# Altium project PCB_Project1.PrjPCB
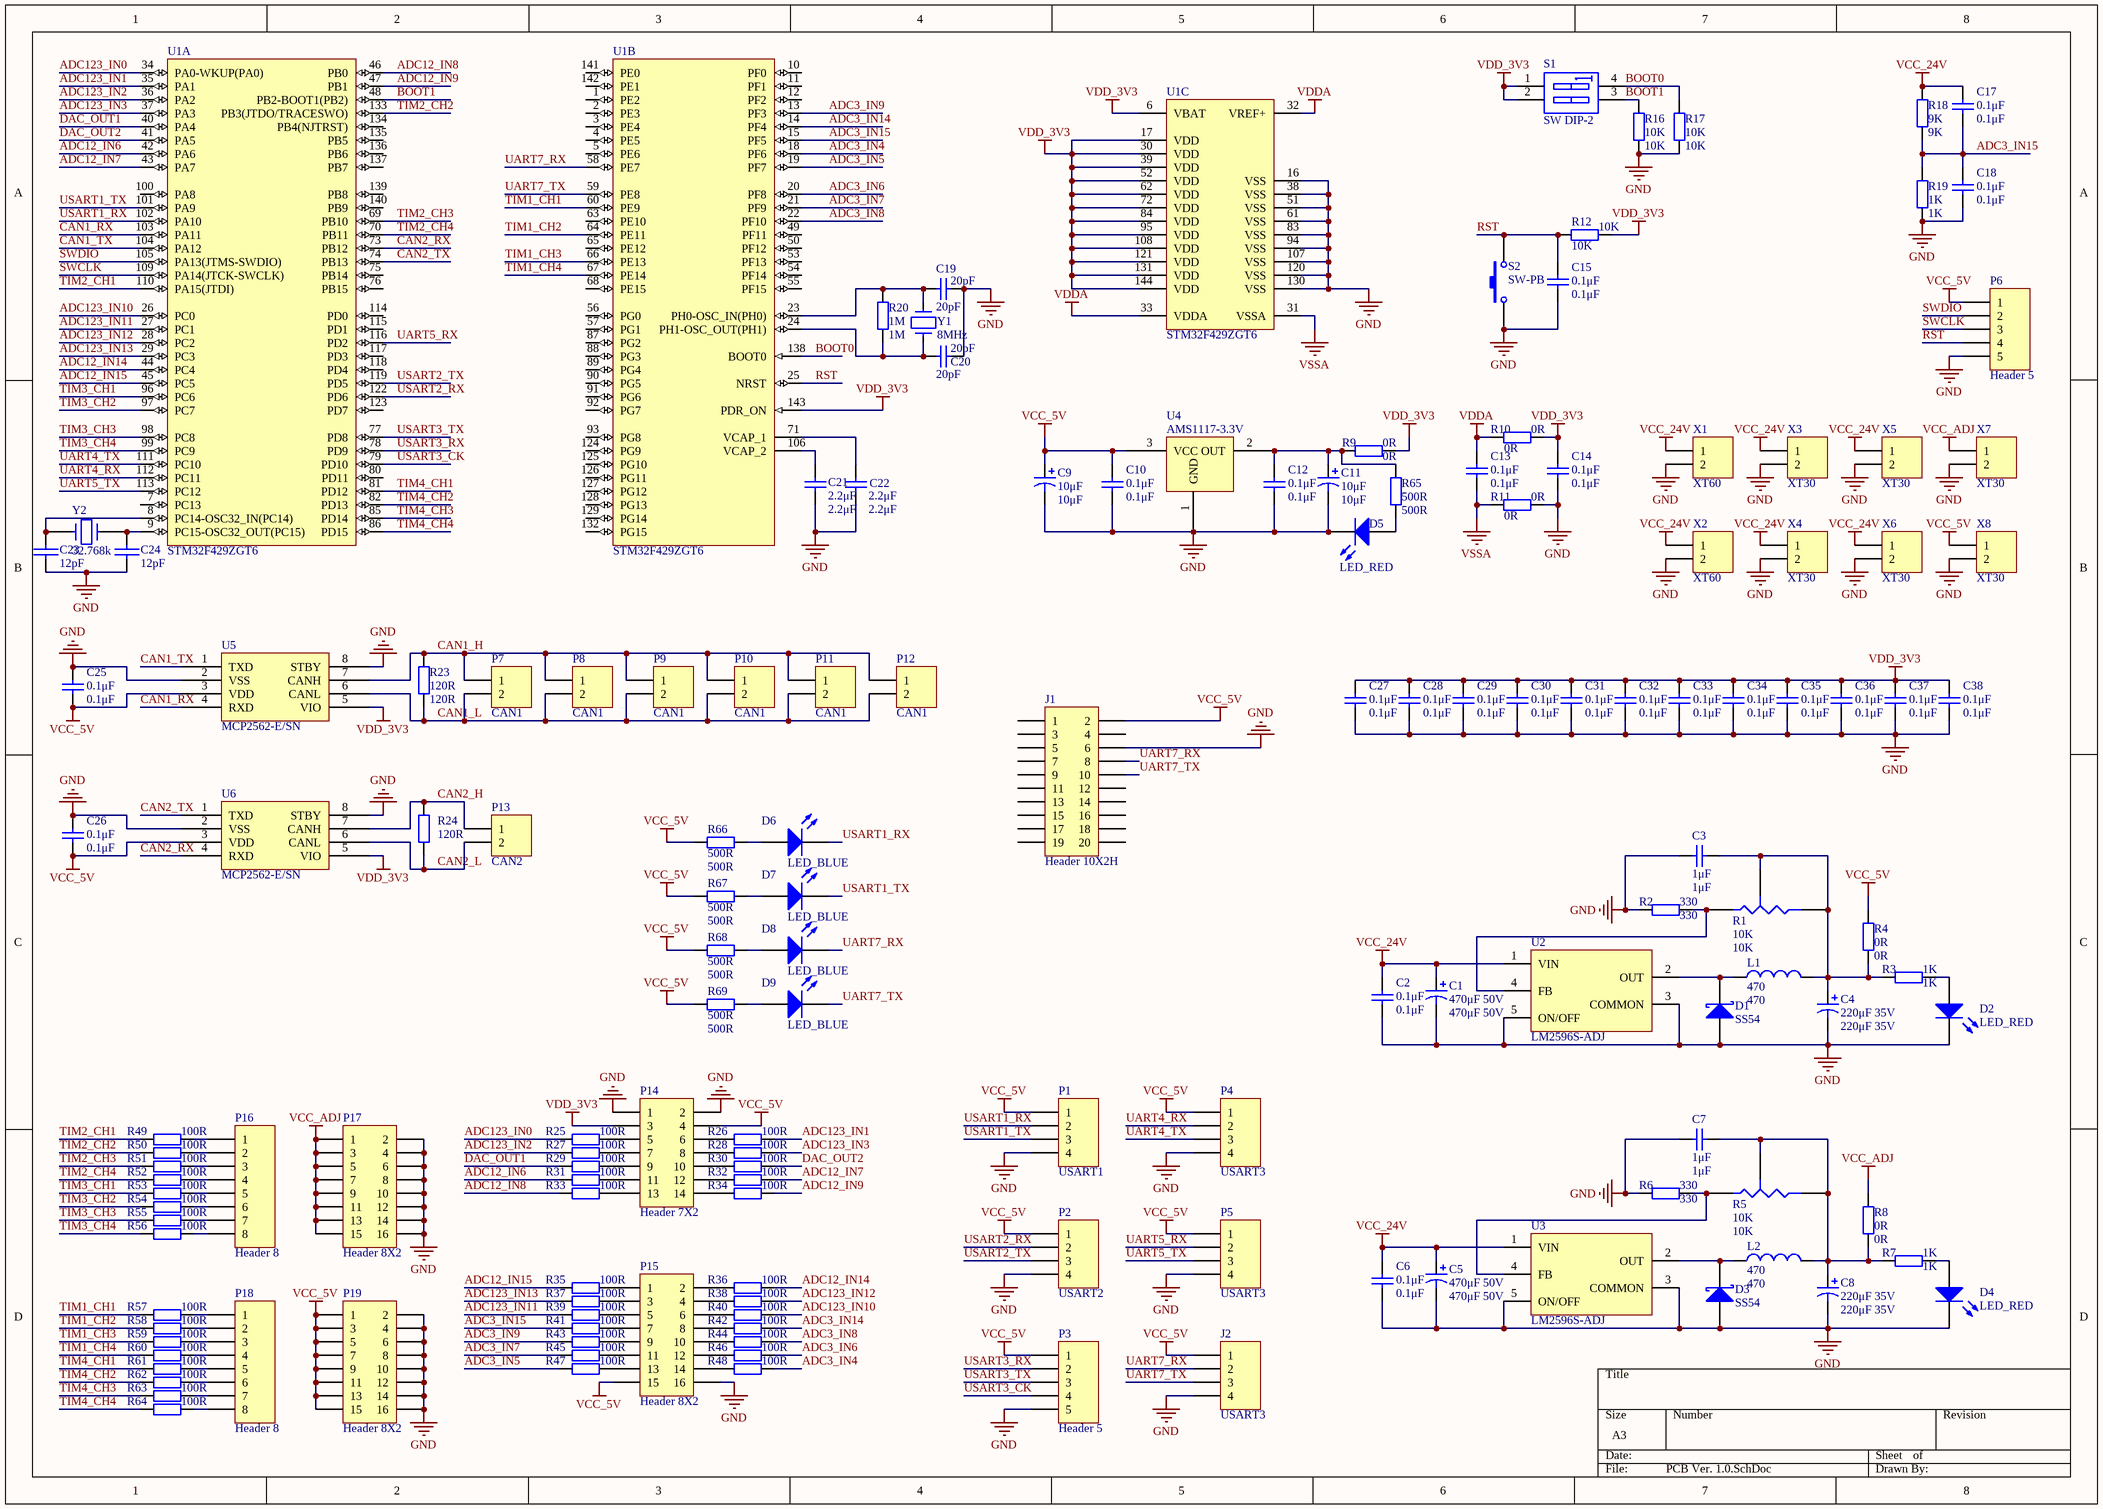
[diagram p0: PCB Ver. 1.0.SchDoc]
1 sheet, 151 parts. Net scope: global (net labels, ports and power ports of the same name join across sheets).
Board file: PCB1.PcbDoc

## Sheet PCB Ver. 1.0.SchDoc
size A3

### Parts
C1  470μF 50V  [RB-.2/.4]
C2  0.1μF  [0805]
C3  1μF  [0805]
C4  220μF 35V  [RB-.2/.4]
C5  470μF 50V  [RB-.2/.4]
C6  0.1μF  [0805]
C7  1μF  [0805]
C8  220μF 35V  [RB-.2/.4]
C9  10μF  [0805]
C10  0.1μF  [0805]
C11  10μF  [0805]
C12  0.1μF  [0805]
C13  0.1μF  [0805]
C14  0.1μF  [0805]
C15  0.1μF  [0805]
C17  0.1μF  [0805]
C18  0.1μF  [0805]
C19  20pF  [0805]
C20  20pF  [0805]
C21  2.2μF  [0805]
C22  2.2μF  [0805]
C23  12pF  [0805]
C24  12pF  [0805]
C25  0.1μF  [0805]
C26  0.1μF  [0805]
C27  0.1μF  [0805]
C28  0.1μF  [0805]
C29  0.1μF  [0805]
C30  0.1μF  [0805]
C31  0.1μF  [0805]
C32  0.1μF  [0805]
C33  0.1μF  [0805]
C34  0.1μF  [0805]
C35  0.1μF  [0805]
C36  0.1μF  [0805]
C37  0.1μF  [0805]
C38  0.1μF  [0805]
D1  SS54  [DO-214AA]
D2  LED_RED  [1206_LED]
D3  SS54  [DO-214AA]
D4  LED_RED  [1206_LED]
D5  LED_RED  [1206_LED]
D6  LED_BLUE  [1206_LED]
D7  LED_BLUE  [1206_LED]
D8  LED_BLUE  [1206_LED]
D9  LED_BLUE  [1206_LED]
J1  Header 10X2H  [HDR2X10]
J2  USART3  [HDR1X4]
L1  470  [12*12*7贴片电感]
L2  470  [12*12*7贴片电感]
P1  USART1  [HDR1X4]
P2  USART2  [HDR1X4]
P3  Header 5  [HDR1X5]
P4  USART3  [HDR1X4]
P5  USART3  [HDR1X4]
P6  Header 5  [HDR1X5]
P7  CAN1  [HDR1X2]
P8  CAN1  [HDR1X2]
P9  CAN1  [HDR1X2]
P10  CAN1  [HDR1X2]
P11  CAN1  [HDR1X2]
P12  CAN1  [HDR1X2]
P13  CAN2  [HDR1X2]
P14  Header 7X2  [HDR2X7]
P15  Header 8X2  [HDR2X8]
P16  Header 8  [HDR1X8]
P17  Header 8X2  [HDR2X8]
P18  Header 8  [HDR1X8]
P19  Header 8X2  [HDR2X8]
R1  10K  [3296]
R2  330  [0805]
R3  1K  [0805]
R4  0R  [0805]
R5  10K  [3296]
R6  330  [0805]
R7  1K  [0805]
R8  0R  [0805]
R9  0R  [0805]
R10  0R  [0805]
R11  0R  [0805]
R12  10K  [0805]
R16  10K  [0805]
R17  10K  [0805]
R18  9K  [0805]
R19  1K  [0805]
R20  1M  [0805]
R23  120R  [0805]
R24  120R  [0805]
R25  100R  [0805]
R26  100R  [0805]
R27  100R  [0805]
R28  100R  [0805]
R29  100R  [0805]
R30  100R  [0805]
R31  100R  [0805]
R32  100R  [0805]
R33  100R  [0805]
R34  100R  [0805]
R35  100R  [0805]
R36  100R  [0805]
R37  100R  [0805]
R38  100R  [0805]
R39  100R  [0805]
R40  100R  [0805]
R41  100R  [0805]
R42  100R  [0805]
R43  100R  [0805]
R44  100R  [0805]
R45  100R  [0805]
R46  100R  [0805]
R47  100R  [0805]
R48  100R  [0805]
R49  100R  [0805]
R50  100R  [0805]
R51  100R  [0805]
R52  100R  [0805]
R53  100R  [0805]
R54  100R  [0805]
R55  100R  [0805]
R56  100R  [0805]
R57  100R  [0805]
R58  100R  [0805]
R59  100R  [0805]
R60  100R  [0805]
R61  100R  [0805]
R62  100R  [0805]
R63  100R  [0805]
R64  100R  [0805]
R65  500R  [0805]
R66  500R  [0805]
R67  500R  [0805]
R68  500R  [0805]
R69  500R  [0805]
S1  SW DIP-2  [DIP-4]
S2  SW-PB  [3*6 开关]
U1  STM32F429ZGT6  [STM-LQFP144_N]  (parts A,B,C of 3)
U2  LM2596S-ADJ  [TO-263]
U3  LM2596S-ADJ  [TO-263]
U4  AMS1117-3.3V  [SOT223]
U5  MCP2562-E/SN  [SO-8]
U6  MCP2562-E/SN  [SO-8]
X1  XT60  [XT60PB]
X2  XT60  [XT60PB]
X3  XT30  [XT30UPB]
X4  XT30  [XT30UPB]
X5  XT30  [XT30UPB]
X6  XT30  [XT30UPB]
X7  XT30  [XT30UPB]
X8  XT30  [XT30UPB]
Y1  8MHz  [XTAL]
Y2  32.768k  [MHDR1X2]

### Nets
GND: C1.2 C2.1 C3.2 C4.2 C5.2 C6.1 C7.2 C8.2 C9.2 C10.1 C11.2 C12.1 C14.1 C15.2 C18.1 C19.2 C20.2 C21.1 C22.1 C23.1 C24.1 C25.2 C26.2 C27.1 C28.1 C29.1 C30.1 C31.1 C32.1 C33.1 C34.1 C35.1 C36.1 C37.1 C38.1 D1.1(A) D2.2(K) D3.1(A) D4.2(K) D5.2(K) J1.6 J2.4 P1.4 P2.4 P3.5 P4.4 P5.4 P6.5 P14.1 P14.2 P15.16 P17.2 P17.4 P17.6 P17.8 P17.10 P17.12 P17.14 P17.16 P19.2 P19.4 P19.6 P19.8 P19.10 P19.12 P19.14 P19.16 R2.1 R6.1 R11.2 R16.1 R17.1 R19.1 S2.1 U1.16(VSS) U1.38(VSS) U1.51(VSS) U1.61(VSS) U1.83(VSS) U1.94(VSS) U1.107(VSS) U1.120(VSS) U1.130(VSS) U2.3(COMMON) U2.5(ON/OFF) U3.3(COMMON) U3.5(ON/OFF) U4.1(GND) U5.2(VSS) U5.8(STBY) U6.2(VSS) U6.8(STBY) X1.2 X2.2 X3.2 X4.2 X5.2 X6.2 X7.2 X8.2
VCC_5V: C9.1 C10.2 C25.1 C26.1 J1.2 J2.1 P1.1 P2.1 P3.1 P4.1 P5.1 P6.1 P14.4 P15.15 P19.1 P19.3 P19.5 P19.7 P19.9 P19.11 P19.13 P19.15 R4.2 R66.2 R67.2 R68.2 R69.2 U4.3(VCC) U5.3(VDD) U6.3(VDD) X8.1
VCC_24V: C1.1 C2.2 C5.1 C6.2 C17.2 R18.2 U2.1(VIN) U3.1(VIN) X1.1 X2.1 X3.1 X4.1 X5.1 X6.1
VCC_ADJ: P17.1 P17.3 P17.5 P17.7 P17.9 P17.11 P17.13 P17.15 R8.2 X7.1
VDD_3V3: C14.2 C27.2 C28.2 C29.2 C30.2 C31.2 C32.2 C33.2 C34.2 C35.2 C36.2 C37.2 C38.2 P14.3 R9.2 R10.2 R12.2 S1.1(A1) S1.2(A2) U1.6(VBAT) U1.17(VDD) U1.30(VDD) U1.39(VDD) U1.52(VDD) U1.62(VDD) U1.72(VDD) U1.84(VDD) U1.95(VDD) U1.108(VDD) U1.121(VDD) U1.131(VDD) U1.143(PDR_ON) U1.144(VDD) U5.5(VIO) U6.5(VIO)
VDDA: C13.2 R10.1 U1.32(VREF+) U1.33(VDDA)
VSSA: C13.1 R11.1 U1.31(VSSA)
ADC3_IN4: R48.2 U1.18(PF6)
ADC3_IN5: R47.1 U1.19(PF7)
ADC3_IN6: R46.2 U1.20(PF8)
ADC3_IN7: R45.1 U1.21(PF9)
ADC3_IN8: R44.2 U1.22(PF10)
ADC3_IN9: R43.1 U1.13(PF3)
ADC3_IN14: R42.2 U1.14(PF4)
ADC3_IN15: C17.1 C18.2 R18.1 R19.2 R41.1 U1.15(PF5)
ADC12_IN6: R31.1 U1.42(PA6)
ADC12_IN7: R32.2 U1.43(PA7)
ADC12_IN8: R33.1 U1.46(PB0)
ADC12_IN9: R34.2 U1.47(PB1)
ADC12_IN14: R36.2 U1.44(PC4)
ADC12_IN15: R35.1 U1.45(PC5)
ADC123_IN0: R25.1 U1.34(PA0-WKUP(PA0))
ADC123_IN1: R26.2 U1.35(PA1)
ADC123_IN2: R27.1 U1.36(PA2)
ADC123_IN3: R28.2 U1.37(PA3)
ADC123_IN10: R40.2 U1.26(PC0)
ADC123_IN11: R39.1 U1.27(PC1)
ADC123_IN12: R38.2 U1.28(PC2)
ADC123_IN13: R37.1 U1.29(PC3)
BOOT0: R17.2 S1.4(B1) U1.138(BOOT0)
BOOT1: R16.2 S1.3(B2) U1.48(PB2-BOOT1(PB2))
CAN1_H: P7.1 P8.1 P9.1 P10.1 P11.1 P12.1 R23.2 U5.7(CANH)
CAN1_L: P7.2 P8.2 P9.2 P10.2 P11.2 P12.2 R23.1 U5.6(CANL)
CAN1_RX: U1.103(PA11) U5.4(RXD)
CAN1_TX: U1.104(PA12) U5.1(TXD)
CAN2_H: P13.1 R24.2 U6.7(CANH)
CAN2_L: P13.2 R24.1 U6.6(CANL)
CAN2_RX: U1.73(PB12) U6.4(RXD)
CAN2_TX: U1.74(PB13) U6.1(TXD)
DAC_OUT1: R29.1 U1.40(PA4)
DAC_OUT2: R30.2 U1.41(PA5)
RST: C15.1 P6.4 R12.1 S2.2 U1.25(NRST)
SWCLK: P6.3 U1.109(PA14(JTCK-SWCLK))
SWDIO: P6.2 U1.105(PA13(JTMS-SWDIO))
TIM1_CH1: R57.1 U1.60(PE9)
TIM1_CH2: R58.1 U1.64(PE11)
TIM1_CH3: R59.1 U1.66(PE13)
TIM1_CH4: R60.1 U1.67(PE14)
TIM2_CH1: R49.1 U1.110(PA15(JTDI))
TIM2_CH2: R50.1 U1.133(PB3(JTDO/TRACESWO))
TIM2_CH3: R51.1 U1.69(PB10)
TIM2_CH4: R52.1 U1.70(PB11)
TIM3_CH1: R53.1 U1.96(PC6)
TIM3_CH2: R54.1 U1.97(PC7)
TIM3_CH3: R55.1 U1.98(PC8)
TIM3_CH4: R56.1 U1.99(PC9)
TIM4_CH1: R61.1 U1.81(PD12)
TIM4_CH2: R62.1 U1.82(PD13)
TIM4_CH3: R63.1 U1.85(PD14)
TIM4_CH4: R64.1 U1.86(PD15)
UART4_RX: P4.2 U1.112(PC11)
UART4_TX: P4.3 U1.111(PC10)
UART5_RX: P5.2 U1.116(PD2)
UART5_TX: P5.3 U1.113(PC12)
UART7_RX: D8.2(K) J1.8 J2.2 U1.58(PE7)
UART7_TX: D9.2(K) J1.10 J2.3 U1.59(PE8)
USART1_RX: D6.2(K) P1.2 U1.102(PA10)
USART1_TX: D7.2(K) P1.3 U1.101(PA9)
USART2_RX: P2.2 U1.122(PD6)
USART2_TX: P2.3 U1.119(PD5)
USART3_CK: P3.4 U1.79(PD10)
USART3_RX: P3.2 U1.78(PD9)
USART3_TX: P3.3 U1.77(PD8)
NetC3_1: C3.1 C4.1 L1.2 R1.2(B) R1.3(TAP) R3.1 R4.1
NetC7_1: C7.1 C8.1 L2.2 R5.2(B) R5.3(TAP) R7.1 R8.1
NetC11_1: C11.1 C12.2 R9.1 R65.2 U4.2(OUT)
NetC19_1: C19.1 R20.2 U1.23(PH0-OSC_IN(PH0)) Y1.1
NetC20_1: C20.1 R20.1 U1.24(PH1-OSC_OUT(PH1)) Y1.2
NetC21_2: C21.2 U1.106(VCAP_2)
NetC22_2: C22.2 U1.71(VCAP_1)
NetC23_2: C23.2 U1.8(PC14-OSC32_IN(PC14)) Y2.2
NetC24_2: C24.2 U1.9(PC15-OSC32_OUT(PC15)) Y2.1
NetD1_2: D1.2(K) L1.1 U2.2(OUT)
NetD2_1: D2.1(A) R3.2
NetD3_2: D3.2(K) L2.1 U3.2(OUT)
NetD4_1: D4.1(A) R7.2
NetD5_1: D5.1(A) R65.1
NetD6_1: D6.1(A) R66.1
NetD7_1: D7.1(A) R67.1
NetD8_1: D8.1(A) R68.1
NetD9_1: D9.1(A) R69.1
NetP14_5: P14.5 R25.2
NetP14_6: P14.6 R26.1
NetP14_7: P14.7 R27.2
NetP14_8: P14.8 R28.1
NetP14_9: P14.9 R29.2
NetP14_10: P14.10 R30.1
NetP14_11: P14.11 R31.2
NetP14_12: P14.12 R32.1
NetP14_13: P14.13 R33.2
NetP14_14: P14.14 R34.1
NetP15_1: P15.1 R35.2
NetP15_2: P15.2 R36.1
NetP15_3: P15.3 R37.2
NetP15_4: P15.4 R38.1
NetP15_5: P15.5 R39.2
NetP15_6: P15.6 R40.1
NetP15_7: P15.7 R41.2
NetP15_8: P15.8 R42.1
NetP15_9: P15.9 R43.2
NetP15_10: P15.10 R44.1
NetP15_11: P15.11 R45.2
NetP15_12: P15.12 R46.1
NetP15_13: P15.13 R47.2
NetP15_14: P15.14 R48.1
NetP16_1: P16.1 R49.2
NetP16_2: P16.2 R50.2
NetP16_3: P16.3 R51.2
NetP16_4: P16.4 R52.2
NetP16_5: P16.5 R53.2
NetP16_6: P16.6 R54.2
NetP16_7: P16.7 R55.2
NetP16_8: P16.8 R56.2
NetP18_1: P18.1 R57.2
NetP18_2: P18.2 R58.2
NetP18_3: P18.3 R59.2
NetP18_4: P18.4 R60.2
NetP18_5: P18.5 R61.2
NetP18_6: P18.6 R62.2
NetP18_7: P18.7 R63.2
NetP18_8: P18.8 R64.2
NetR1_1: R1.1(A) R2.2 U2.4(FB)
NetR5_1: R5.1(A) R6.2 U3.4(FB)

Not connected (* = marked no-connect by the designer): J1 1 3 4 5 7 9 11 12 13 14 15 16 17 18 19 20; U1 1(PE2) 2(PE3) 3(PE4) 4(PE5) 5(PE6) 7(PC13) 10(PF0) 11(PF1) 12(PF2) 49(PF11) 50(PF12) 53(PF13) 54(PF14) 55(PF15) 56(PG0) 57(PG1) 63(PE10) 65(PE12) 68(PE15) 75(PB14) 76(PB15) 80(PD11) 87(PG2) 88(PG3) 89(PG4) 90(PG5) 91(PG6) 92(PG7) 93(PG8) 100(PA8) 114(PD0) 115(PD1) 117(PD3) 118(PD4) 123(PD7) 124(PG9) 125(PG10) 126(PG11) 127(PG12) 128(PG13) 129(PG14) 132(PG15) 134(PB4(NJTRST)) 135(PB5) 136(PB6) 137(PB7) 139(PB8) 140(PB9) 141(PE0) 142(PE1)

### Library data of the parts
C1 C4 C5 C8 C9 C11 = Cap Pol1: Polarized Capacitor (Radial); Published: 8-Jun-2000; LatestRevisionDate: 17-Jul-2002; LatestRevisionNote: Re-released for DXP Platform.; PackageReference: RB7.6-15; Publisher: Altium Limited; PackageDescription: Polarized Capacitor (Radial); 2 Leads
  C1 C5: Value: 470μF 50V
  C4 C8: Value: 220μF 35V
  C9 C11: Value: 10μF
C2 C3 C6 C7 C10 C12-C15 C17-C22 C25-C38 = Cap: Capacitor; Published: 8-Jun-2000; LatestRevisionDate: 17-Jul-2002; LatestRevisionNote: Re-released for DXP Platform.; PackageReference: RAD-0.3; Publisher: Altium Limited; PackageDescription: Radial Cap, Thru-Hole; 2 Leads; 0.3 in Pin Spacing
  C2 C6 C10 C12-C15 C17 C18 C25-C38: Value: 0.1μF
  C3 C7: Value: 1μF
  C19 C20: Value: 20pF
  C21 C22: Value: 2.2μF
C23 C24 = CAP: Capcitor
D1 D3 = Diode 11DQ03: Schottky Rectifier; Published: 8-Jun-2000; LatestRevisionDate: 17-Jul-2002; LatestRevisionNote: Re-released for DXP Platform.; DatasheetVersion: Dec-1997; PackageReference: DO-204AL; Publisher: Altium Limited; PackageDescription: Diode, Axial; Body 5.2 x 2.7 mm (LxDia. max), Lead Dia. 0.86 mm (max); Code_JEDEC: DO-204-AL; ComponentLink1Description: Manufacturer Link; ComponentLink1URL: http://www.irf.com/; ComponentLink2Description: Datasheet; ComponentLink2URL: http://www.irf.com/product-info/datasheets/data/11dq03.pdf
D2 D4-D9 = LED3: Typical BLUE SiC LED; Published: 8-Jun-2000; LatestRevisionDate: 17-Dec-2003; LatestRevisionNote: PCB Footprint replaced.; DatasheetVersion: 16-Apr-2002; PackageVersion: 16-Apr-2002; PackageReference: 3.5X2.8X1.9; Publisher: Altium Limited; PackageDescription: SM LED; 2 C-Bend Leads; Body 3.5 x 2.8 x 1.9 mm, inc leads (LxWxH typ)
J1 = Header 10X2H: Header, 10-Pin, Dual row, Right Angle; LatestRevisionDate: 17-Jul-2002; LatestRevisionNote: Re-released for DXP Platform.; Publisher: Altium Limited
J2 P1 P2 P4 P5 = Header 4: Header, 4-Pin; LatestRevisionDate: 17-Jul-2002; LatestRevisionNote: Re-released for DXP Platform.; Publisher: Altium Limited
L1 L2 = Inductor: Code_IEC: 1005; Published: 8-Jun-2000; LatestRevisionDate: 29-May-2009; LatestRevisionNote: IPC-7351 Footprint Added.; PackageReference: 0402-A; Publisher: Altium Limited; PackageDescription: Chip Inductor; Code_JEITA: 0402; Value: 470
P3 P6 = Header 5: Header, 5-Pin; LatestRevisionDate: 17-Jul-2002; LatestRevisionNote: Re-released for DXP Platform.; Publisher: Altium Limited
P7-P13 X1-X8 = Header 2: Header, 2-Pin; LatestRevisionDate: 17-Jul-2002; LatestRevisionNote: Re-released for DXP Platform.; Publisher: Altium Limited
P14 = Header 7X2: Header, 7-Pin, Dual row; LatestRevisionDate: 17-Jul-2002; LatestRevisionNote: Re-released for DXP Platform.; Publisher: Altium Limited
P15 P17 P19 = Header 8X2: Header, 8-Pin, Dual row; LatestRevisionDate: 17-Jul-2002; LatestRevisionNote: Re-released for DXP Platform.; Publisher: Altium Limited
P16 P18 = Header 8: Header, 8-Pin; LatestRevisionDate: 17-Jul-2002; LatestRevisionNote: Re-released for DXP Platform.; Publisher: Altium Limited
R1 R5 = Res Tap: Tapped Resistor; Sim Note: Enter the Resistance value and the set point into parameter fields.; Set Position: 0.5; Published: 24-Mar-1999; LatestRevisionDate: 17-Jul-2002; LatestRevisionNote: Re-released for DXP Platform.; PackageReference: VR3; Publisher: Altium Limited; PackageDescription: Variable Resistor, Thru-Hole; 3 Leads; Value: 10K
R2-R4 R6-R12 R16-R20 R23-R69 = Res2: Resistor; Published: 8-Jun-2000; LatestRevisionDate: 17-Jul-2002; LatestRevisionNote: Re-released for DXP Platform.; PackageReference: AXIAL-0.4; Publisher: Altium Limited; PackageDescription: Axial Device, Thru-Hole; 2 Leads; 0.4 in Pin Spacing
  R2 R6: Value: 330
  R3 R7 R19: Value: 1K
  R4 R8-R11: Value: 0R
  R12 R16 R17: Value: 10K
  R18: Value: 9K
  R20: Value: 1M
  R23 R24: Value: 120R
  R25-R64: Value: 100R
  R65-R69: Value: 500R
S1 = SW DIP-2: DIP Switch, 2 Position, SPST; Published: 24-Mar-1999; LatestRevisionDate: 17-Jul-2002; LatestRevisionNote: Re-released for DXP Platform.; PackageReference: DIP-4; Publisher: Altium Limited
S2 = SW-PB: Switch; Published: 24-Mar-1999; LatestRevisionDate: 17-Jul-2002; LatestRevisionNote: Re-released for DXP Platform.; PackageReference: SPST-2; Publisher: Altium Limited; PackageDescription: Switch; 2 Leads
U1 = STM32F429ZGT6: ARM Cortex-M4 32-bit MCU+FPU, 225 DMIPS, 1024 kB Flash, 256 kB Internal RAM, 114 I/Os, 144-pin LQFP, -40 to 85 degC, Tray; Manufacturer: STMicroelectronics; D/A Converter: 2x12-bit; FLASH Size (Prog) (kB): 1024; I/Os (High Current): 114; Internal RAM Size (kB): 256; Operating Frequency(F) (Processor speed) (MHz): 180; Supply Voltage(Vcc) max (V): 3.6; Supply Voltage(Vcc) min (V): 1.8; DatasheetVersion: Rev. 2; PackageVersion: Rev. 4, 06/2013; PackageReference: LQFP144; PackageDescription: 144-Pin Low Profile Quad Flat Package, 20 x 20 mm Body, 0.5 mm Pitch; Supplier 1: Digi-Key; Supplier Part Number 1: STM32F429ZGT6-ND; Supplier 2: Newark; Supplier Part Number 2: 06X3675; Supplier 3: Mouser; Supplier Part Number 3: 511-STM32F429ZGT6; Core: ARM Cortex-M4; Packing: Tray; Mounting Technology: Surface Mount; PartNumber: STM32F429ZGT6; ComponentLink1Description: Manufacturer URL; ComponentLink1URL: http://www.st.com/web/en/home.html; ComponentLink2Description: Datasheet; ComponentLink2URL: http://www.st.com/st-web-ui/static/active/en/resource/technical/document/data_brief/DM00053488.pdf; ComponentLink3Description: Package Specification; ComponentLink3URL: http://www.st.com/st-web-ui/static/active/en/resource/technical/document/datasheet/DM00037051.pdf
U2 U3 = LM2576S-5.0: CI-LM2576S-5.0
U4 = 11
U5 U6 = MCP2562-E/MF
Y1 = XTAL: Crystal Oscillator; 封装: HC-49
Y2 = CRYSTAL: Crystal 8MHz PLUG; 封装: TC38; Value: 8MHz